# EAGLE design LCD_Backpack_1.8_TFT (EAGLE 5.07)
PROJECT: USB 1,8" TFT BREAKOUT
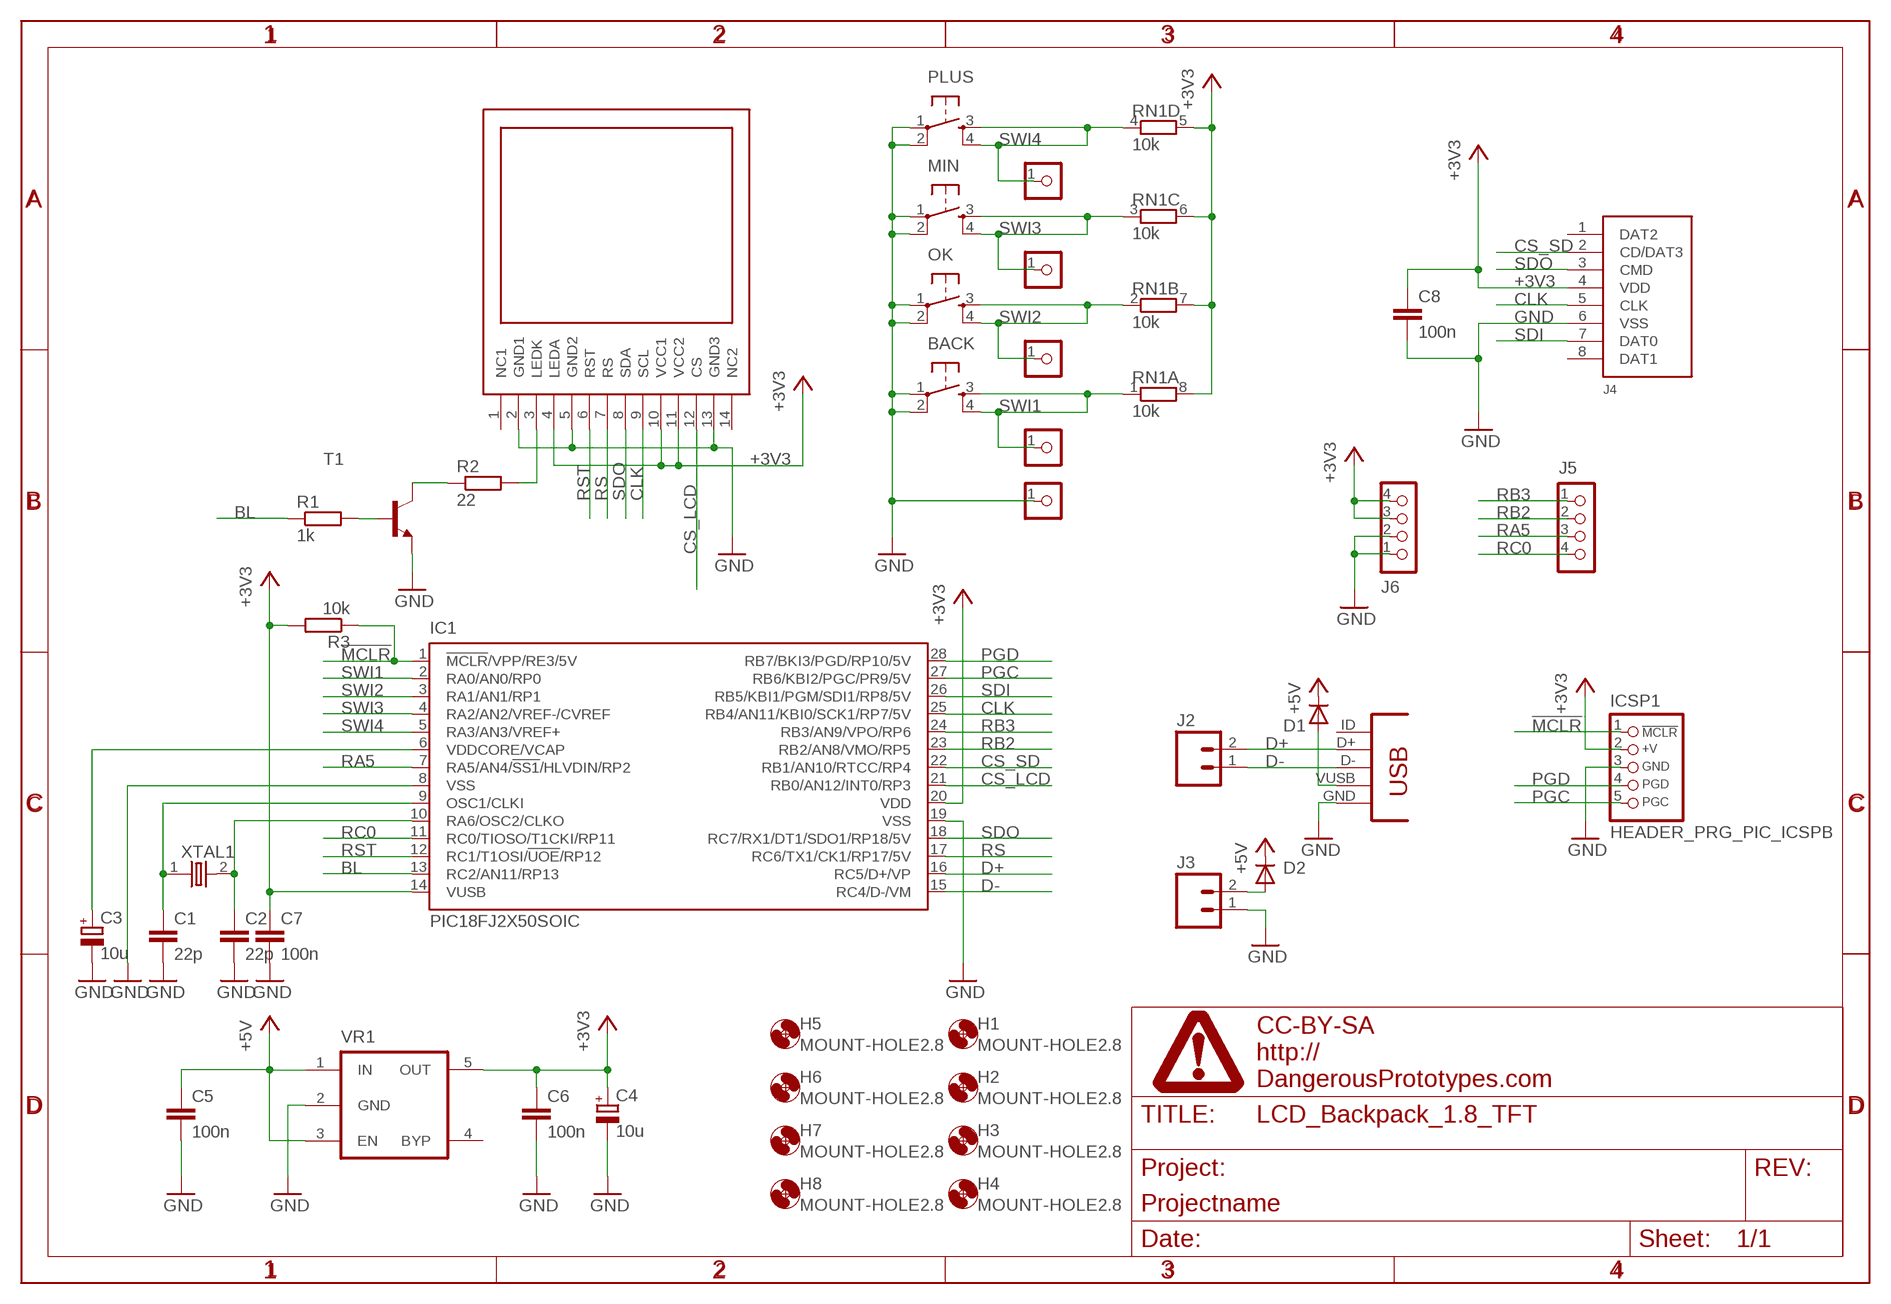
[diagram p0: schematic, sheet 1]

## Parts
BACK  SW-SMD-SMALL  [TACT_SWITCH_SMALL]
C1  22p  CAPC603  [C603]
C2  22p  CAPC603  [C603]
C3  10u  CAP_POLSMC_A  [SMC_A]
C4  10u  CAP_POLSMC_A  [SMC_A]
C5  100n  CAPC603  [C603]
C6  100n  CAPC603  [C603]
C7  100n  CAPC603  [C603]
C8  100n  CAPC603  [C603]
D1  DIODE-SOD-123  [SOD-123]
D2  DIODE-SOD-123  [SOD-123]
H1  MOUNT-HOLE2.8  [2,8]
H2  MOUNT-HOLE2.8  [2,8]
H3  MOUNT-HOLE2.8  [2,8]
H4  MOUNT-HOLE2.8  [2,8]
H5  MOUNT-HOLE2.8  [2,8]
H6  MOUNT-HOLE2.8  [2,8]
H7  MOUNT-HOLE2.8  [2,8]
H8  MOUNT-HOLE2.8  [2,8]
IC1  PIC18FJ2X50SOIC  [SOIC28W]
ICSP1  HEADER_PRG_PIC_ICSPB  [HEADER_PRG_1X05_ICSP_B]
J1  CON-USB-MINI-BUSB1  [CONN_USB_MINI-B]
J2  M02PTH  [1X02]
J3  M02PTH  [1X02]
J4  CON_MICROSDHINGED  [CON_MICROSD_HINGED]
J5  CON_HEADER_1X04  [M1X4]
J6  CON_HEADER_1X04  [M1X4]
J7  CON_HEADER_1X01-PTH  [M1X1]
J8  CON_HEADER_1X01-PTH  [M1X1]
J9  CON_HEADER_1X01-PTH  [M1X1]
J10  CON_HEADER_1X01-PTH  [M1X1]
J11  CON_HEADER_1X01-PTH  [M1X1]
MIN  SW-SMD-SMALL  [TACT_SWITCH_SMALL]
OK  SW-SMD-SMALL  [TACT_SWITCH_SMALL]
PLUS  SW-SMD-SMALL  [TACT_SWITCH_SMALL]
R1  1k  RESISTORR603  [R603]
R2  22  RESISTORR603  [R603]
R3  10k  RESISTORR603  [R603]
RN1  10k  RNETWORK  [RN8P-4R-CRA06S]
T1  BJT-NPNSOT23BEC  [SOT23-BEC]
U$1  LCD18  [LCD18]
U$4  DINA4_L  [DP_LOGO]
VR1  MIC5205  [SOT-23-5]
XTAL1  OSC-XTAL  [HC-49U]

## Nets
!MCLR: IC1.1(!MCLR!/VPP/RE3/5V) ICSP1.1(/MCLR) R3.1
+3V3: C4.+ C6.1 C7.1 C8.1 IC1.14(VUSB) IC1.20(VDD) ICSP1.2(+V) J4.4(VDD) J6.3 J6.4 R3.2 RN1.5 RN1.6 RN1.7 RN1.8 U$1.4(LEDA) U$1.10(VCC1) U$1.11(VCC2) VR1.5(OUT)
+5V: C5.1 D1.C D2.C VR1.1(IN) VR1.3(EN)
BL: IC1.13(RC2/AN11/RP13) R1.1
CLK: IC1.25(RB4/AN11/KBI0/SCK1/RP7/5V) J4.5(CLK) U$1.9(SCL)
CS_LCD: IC1.21(RB0/AN12/INT0/RP3) U$1.12(CS)
CS_SD: IC1.22(RB1/AN10/RTCC/RP4) J4.2(CD/DAT3)
D+: IC1.16(RC5/D+/VP) J1.D+ J2.2
D-: IC1.15(RC4/D-/VM) J1.D- J2.1
GND: BACK.1 BACK.2 C1.2 C2.2 C3.- C4.- C5.2 C6.2 C7.2 C8.2 IC1.8(VSS) IC1.19(VSS) ICSP1.3(GND) J1.GND J3.1 J4.6(VSS) J6.1 J6.2 J11.1 MIN.1 MIN.2 OK.1 OK.2 PLUS.1 PLUS.2 T1.E U$1.2(GND1) U$1.5(GND2) U$1.13(GND3) VR1.2(GND)
N$1: C3.+ IC1.6(VDDCORE/VCAP)
N$2: D1.A J1.VUSB
N$3: D2.A J3.2
N$13: C1.1 IC1.9(OSC1/CLKI) XTAL1.1
N$14: C2.1 IC1.10(RA6/OSC2/CLKO) XTAL1.2
N$15: R2.1 T1.C
N$18: R2.2 U$1.3(LEDK)
N$19: R1.2 T1.B
PGC: IC1.27(RB6/KBI2/PGC/PR9/5V) ICSP1.5(PGC)
PGD: IC1.28(RB7/BKI3/PGD/RP10/5V) ICSP1.4(PGD)
RA5: IC1.7(RA5/AN4/!SS1!/HLVDIN/RP2) J5.3
RB2: IC1.23(RB2/AN8/VMO/RP5) J5.2
RB3: IC1.24(RB3/AN9/VPO/RP6) J5.1
RC0: IC1.11(RC0/TIOSO/T1CKI/RP11) J5.4
RS: IC1.17(RC6/TX1/CK1/RP17/5V) U$1.7(RS)
RST: IC1.12(RC1/T1OSI/!UOE!/RP12) U$1.6(RST)
SDI: IC1.26(RB5/KBI1/PGM/SDI1/RP8/5V) J4.7(DAT0)
SDO: IC1.18(RC7/RX1/DT1/SDO1/RP18/5V) J4.3(CMD) U$1.8(SDA)
SWI1: BACK.3 BACK.4 IC1.2(RA0/AN0/RP0) J10.1 RN1.1
SWI2: IC1.3(RA1/AN1/RP1) J9.1 OK.3 OK.4 RN1.2
SWI3: IC1.4(RA2/AN2/VREF-/CVREF) J8.1 MIN.3 MIN.4 RN1.3
SWI4: IC1.5(RA3/AN3/VREF+) J7.1 PLUS.3 PLUS.4 RN1.4
Unconnected: J1.BODY@1(BODY) J1.BODY@2(BODY) J1.BODY@3(BODY) J1.BODY@4(BODY) J1.ID(USBID) J4.1(DAT2) J4.8(DAT1) U$1.1(NC1) U$1.14(NC2) VR1.4(BYP)

## Library data of the parts
BACK MIN OK PLUS = dp_devices:SW-SMD-SMALL
C1 C2 C5-C8 = dp_devices:CAP
C3 C4 = dp_devices:CAP_POL
D1 D2 = dp_devices:DIODE: Various Diode Packages
H1-H8 = holes:MOUNT-HOLE: MOUNTING HOLE with drill center marker
IC1 = dp_devices:PIC18FJ2X50
ICSP1 = dp_devices:HEADER_PRG_PIC_ICSP: 5-pin PIC In Circuit Serial Programming header
J1 = dp_devices:CON-USB-MINI-B: USB connector
J2 J3 = SparkFun2:M02: Header 2 Standard 2-pin 0.1" header. Use with straight break away headers (SKU : PRT-00116), right angle break away headers (PRT-00553), swiss pins (PRT-00743), machine pins (PRT-00117), and female headers (PRT-00115). Molex polarized connector foot print use with SKU : PRT-08233 with associated crimp pins and housings.
J4 = dp_devices:CON_MICROSD
J5 J6 = dp_devices:CON_HEADER_1X04
J7-J11 = dp_devices:CON_HEADER_1X01
R1-R3 = dp_devices:RESISTOR
RN1 = dp_devices:RNETWORK: 4 Resistor Array 0603
T1 = dp_devices:BJT-NPN: Most commonly used is SOT23-BEC
U$1 = lcd:LCD18
U$4 = dp_devices:DINA4_L: A4 DP frame Standard Dangerous Prototypes schematic frame. Automagically adds the DP logo and standard texts to the PCB Use the atrribute in the schematic editor to change the fields.; FF1: fulfillment by; FF2: Seeed Studio; FF3: www.seeedstudio.com; LICENSE: CC-BY-SA; PROJECT: Projectname; URL1: http://; URL2: DangerousPrototypes.com
VR1 = dp_devices:MIC5205: 150ma Low-Noise LDO Regulator
XTAL1 = dp_devices:OSC-XTAL

## Board
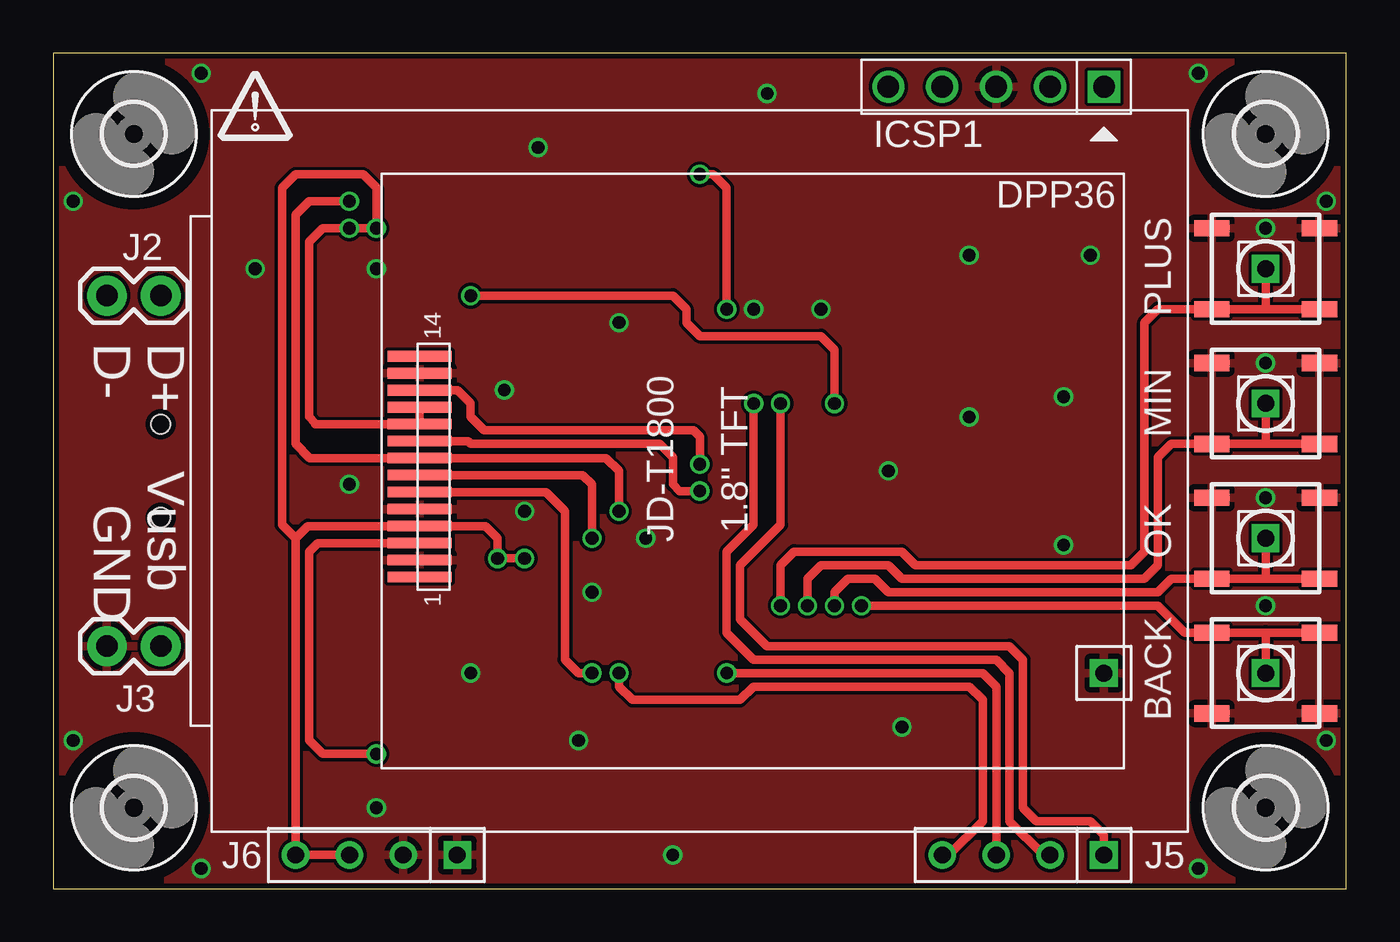
[diagram p1: board, top side]
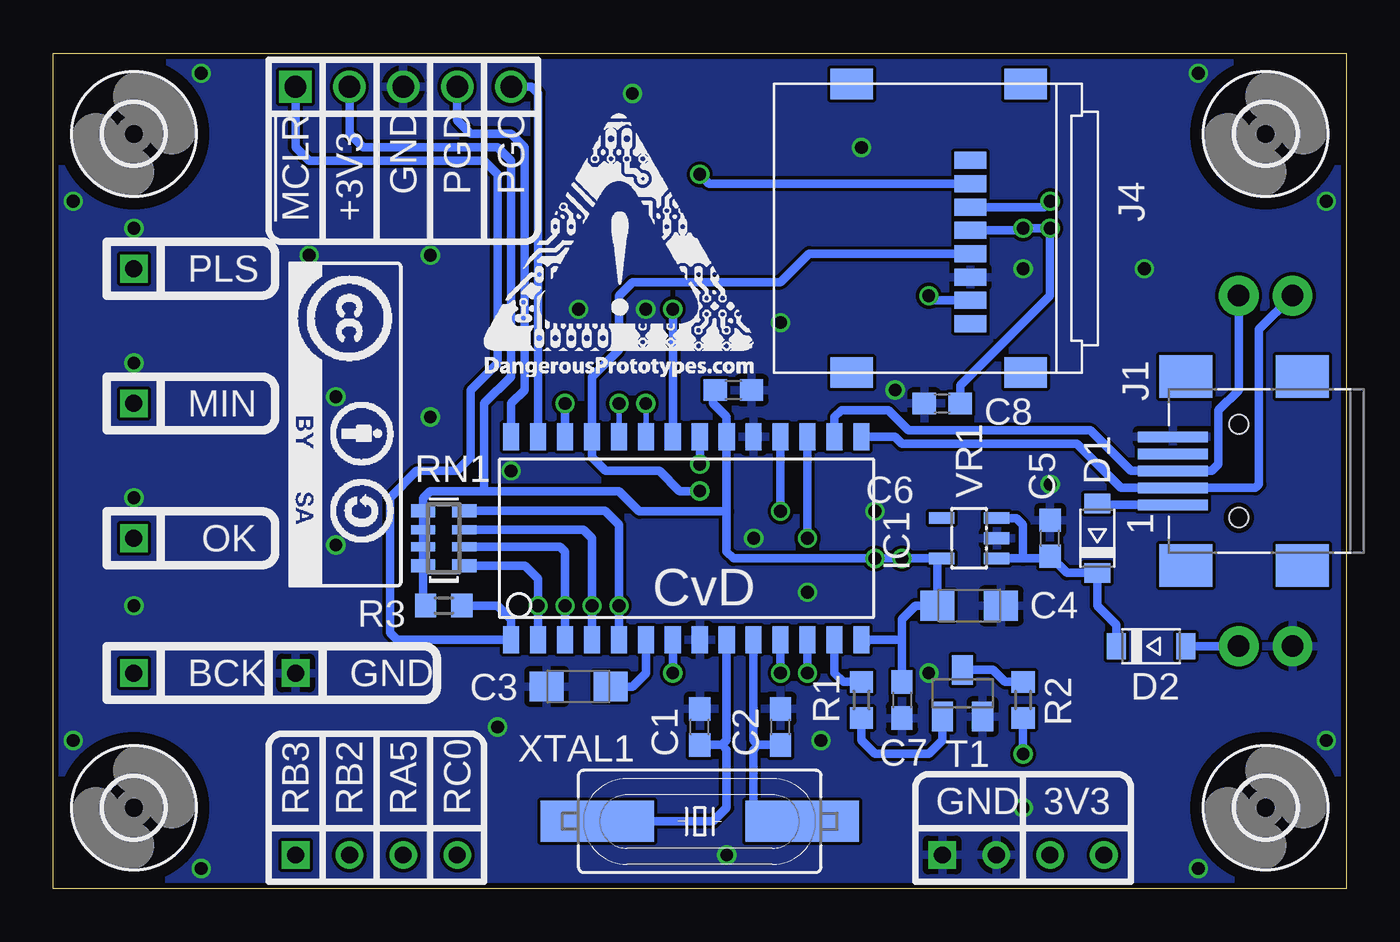
[diagram p2: board, bottom side, seen from below]

Size 60.96 x 39.37 mm. Coordinates in mm from the lower left corner, seen from the top.
Outline: 60.96,39.37 0,39.37 0,0 60.96,0 60.96,39.37
Copper layers (1*16): Top 0.035mm / dielectric 1.5mm / Bottom 0.035mm
Design rules "Fusion_eagle_rule_v1.1": minimum track width 6mil, minimum drill 12mil, track to track 6mil, track to pad 6mil, pad to pad 6mil, via to via 6mil, smd to smd 0mil, copper to edge 10mil, drill to drill 10mil, minimum pad ring 10mil, minimum via ring 6mil, stop-mask expansion 2mil, vias tented up to drill 100mil, thermal gap 10mil

### Footprints (pad centres in the part's own frame; a part is rotated, then mirrored left to right if it is on the bottom)
TACT_SWITCH_SMALL = smd 1.651 x 0.762: 1 -2.54,1.905; 2 2.54,1.905; 3 -2.54,-1.905; 4 2.54,-1.905
C603 = smd 1.1 x 1: 1 -0.85,0; 2 0.85,0
SMC_A = smd 1.6 x 1.4: + -1.5,0; - 1.5,0
SOD-123 = smd 0.91 x 1.22: A 1.635,0; C -1.635,0
2,8 = hole 2.8: 0,0
SOIC28W = smd 0.762 x 1.27: 1 -8.89,-4.78; 2 -7.62,-4.78; 3 -6.35,-4.78; 4 -5.08,-4.78; 5 -3.81,-4.78; 6 -2.54,-4.78; 7 -1.27,-4.78; 8 0,-4.78; 9 1.27,-4.78; 10 2.54,-4.78; 11 3.81,-4.78; 12 5.08,-4.78; 13 6.35,-4.78; 14 7.62,-4.78; 15 7.62,4.78; 16 6.35,4.78; 17 5.08,4.78; 18 3.81,4.78; 19 2.54,4.78; 20 1.27,4.78; 21 0,4.78; 22 -1.27,4.78; 23 -2.54,4.78; 24 -3.81,4.78; 25 -5.08,4.78; 26 -6.35,4.78; 27 -7.62,4.78; 28 -8.89,4.78
HEADER_PRG_1X05_ICSP_B = drill 1.016 square: 1 -5.08,0 | drill 1.016 round: 2 -2.54,0; 3 0,0; 4 2.54,0; 5 5.08,0
CONN_USB_MINI-B = smd 2 x 2.5: BODY@1 -4.45,2.5; BODY@2 4.45,2.5; BODY@3 4.45,-3; BODY@4 -4.45,-3 | smd 0.5 x 3.3: D+ 0,3.1; D- -0.8,3.1; GND 1.6,3.1; ID 0.8,3.1; VUSB -1.6,3.1 | hole 0.9: -2.2,0; 2.2,0
1X02 = drill 1.016 pad 1.88 round: 1 0,0; 2 2.54,0
CON_MICROSD_HINGED = smd 0.8 x 1.5: 1 -3.2,2.6; 2 -2.1,2.6; 3 -1,2.6; 4 0.1,2.6; 5 1.2,2.6; 6 2.3,2.6; 7 3.4,2.6; 8 4.5,2.6 | smd 1.45 x 2: BODY@1 -6.8,5.2; BODY@2 -6.8,-3; BODY@3 6.8,-3; BODY@4 6.8,5.2
M1X4 = drill 0.8 square: 1 0,0 | drill 0.8 round: 2 2.54,0; 3 5.08,0; 4 7.62,0
M1X1 = drill 0.8 square: 1 0,0
R603 = smd 1 x 1.1: 1 -0.85,0; 2 0.85,0
RN8P-4R-CRA06S = smd 0.63 x 1.15: 1 -1.295,-0.975; 4 1.295,-0.975; 5 1.295,0.975; 8 -1.295,0.975 | smd 0.44 x 1.15: 2 -0.4,-0.975; 3 0.4,-0.975; 6 0.4,0.975; 7 -0.4,0.975
SOT23-BEC = smd 1 x 1.4: B -0.95,-1.1; C 0,1.1; E 0.95,-1.1
LCD18 = smd 3 x 0.5: 1 13.2,5; 2 13.2,4.2; 3 13.2,3.4; 4 13.2,2.6; 5 13.2,1.8; 6 13.2,1; 7 13.2,0.2; 8 13.2,-0.6; 9 13.2,-1.4; 10 13.2,-2.2; 11 13.2,-3; 12 13.2,-3.8; 13 13.2,-4.6; 14 13.2,-5.4
SOT-23-5 = smd 0.55 x 1.2: 1 -0.95,-1.3; 2 0,-1.3; 3 0.95,-1.3; 4 0.95,1.3; 5 -0.95,1.3
HC-49U = smd 5.334 x 1.93: 1 -4.826,0; 2 4.826,0

### Placement (x,y rotation side)
BACK  57.15,10.16 180 top
C1  30.48,7.62 90 bottom
C2  26.67,7.62 90 bottom
C3  36.2,9.53 180 bottom
C4  17.78,13.34 0 bottom
C5  13.97,16.51 90 bottom
C6  28.89,23.5 0 bottom
C7  20.95,8.89 270 bottom
C8  19.05,22.86 180 bottom
D1  11.75,16.51 90 bottom
D2  9.21,11.43 0 bottom
H1  3.81,3.81 180 bottom
H2  3.81,35.56 180 bottom
H3  57.15,35.56 180 bottom
H4  57.15,3.81 180 bottom
H5  3.81,35.56 0 top
H6  3.81,3.81 0 top
H7  57.15,3.81 0 top
H8  57.15,35.56 0 top
IC1  30.48,16.51 0 bottom
ICSP1  44.45,37.78 180 top
J1  5.08,19.68 90 bottom
J2  2.54,27.94 0 top
J3  2.54,11.43 0 top
J4  20.32,31.11 270 bottom
J5  49.53,1.59 180 top
J6  19.05,1.59 180 top
J7  57.15,29.21 0 top
J8  57.15,22.86 0 top
J9  57.15,16.51 0 top
J10  57.15,10.16 0 top
J11  49.53,10.16 0 top
MIN  57.15,22.86 0 top
OK  57.15,16.51 0 top
PLUS  57.15,29.21 0 top
R1  22.86,8.89 270 bottom
R2  15.24,8.89 270 bottom
R3  42.55,13.34 180 bottom
RN1  42.55,16.51 90 bottom
T1  18.1,9.21 0 bottom
U$1  30.48,19.68 180 top
U$2  [DP_LOGO_ART_0.5X0.5]  40.64,24.13 0 bottom
U$3  [CC-BY-SA]  49.85,29.53 270 bottom
U$4  9.53,35.88 0 top
VR1  17.78,16.51 90 bottom
XTAL1  30.48,3.17 0 bottom

### Tracks (layer width: path | path; a pad name or v marks a point on that pad's centre or on a via)
!MCLR
  Bottom 0.406: R3.1 40.01,13.34 39.37,12.7 IC1.1 44.75,11.73 45.09,12.06 45.09,18.41 43.81,19.68 41.91,19.68 41.27,20.32 41.27,23.5 40.01,24.77 40.01,33.66 40.64,34.29 48.9,34.29 49.53,34.92 ICSP1.1
+3V3  (via drill 0.6)
  Top 0.406: U$1.11 U$1.10 12.36,21.89 12.36,21.93 12.06,22.23 12.06,30.48 12.7,31.11 v15.24,31.11 15.24,33.02 14.61,33.66 11.43,33.66 10.79,33.02 10.79,17.14 11.43,16.51 | J6.3 J6.4 11.43,16.51 | v22.23,15.56 v20.95,15.56 20.95,16.51 20.38,17.09 U$1.4 12.01,17.09 11.43,16.51
  Bottom 0.406: 22.64,11.52 IC1.14 20.95,11.73 | VR1.5 19.05,15.53 | 29.21,17.78 IC1.20 29.21,22.23 29.84,22.86 29.84,23.39 C6.1 | 29.21,17.78 29.21,15.88 28.89,15.56 VR1.5 | 20.95,11.73 C7.1 | 20.95,11.73 20.95,12.7 20.32,13.34 C4.+ 19.28,15.36 VR1.5 | R3.2 43.52,13.46 RN1.8 RN1.7 RN1.6 RN1.5 43.52,18.39 43.18,18.73 40.64,18.73 | 40.64,18.73 34.29,18.73 33.34,17.78 29.21,17.78 | 40.64,18.73 40.64,22.86 39.37,24.13 39.37,34.29 40.01,34.92 46.35,34.92 46.99,35.56 ICSP1.2 | J4.4 15.34,31.02 v15.24,31.11 v13.97,31.11 13.97,27.94 18.2,23.71 C8.1 | v20.95,15.56 VR1.5
+5V
  Bottom 0.406: 15.24,15.56 VR1.1 | 15.24,15.56 14.07,15.56 C5.1 13.19,14.88 D1.C 11.75,13.34 10.84,12.43 D2.C | VR1.3 15.55,17.46 15.24,17.14 15.24,15.56
BL
  Bottom 0.406: IC1.13 24.13,10.16 23.71,9.74 R1.1
CLK  (via drill 0.6)
  Top 0.406: v30.48,18.73 29.53,18.73 29.21,19.05 29.21,20.32 28.57,20.95 19.68,20.95 19.55,21.09 U$1.9
  Bottom 0.406: J4.5 25.33,29.91 26.67,28.57 33.66,28.57 34.29,27.94 34.29,25.4 35.56,24.13 IC1.25 35.56,20.32 34.92,19.68 32.38,19.68 31.43,18.73 v30.48,18.73
CS_LCD  (via drill 0.6)
  Top 0.406: U$1.12 19.06,23.48 19.68,22.86 19.68,22.23 20.32,21.59 30.18,21.59 IC1.21 v30.48,20
  Bottom 0.406: v30.48,20 IC1.21
CS_SD  (via drill 0.6)
  Top 0.406: v31.75,27.3 31.75,33.02 31.11,33.66 v30.48,33.66
  Bottom 0.406: v31.75,27.3 IC1.22 | J4.2 30.04,33.22 v30.48,33.66
D+
  Bottom 0.406: J2.2 5.08,23.5 6.03,22.54 6.03,20 6.35,19.68 J1.D+ 10.16,19.68 12.06,21.59 20.64,21.59 21.59,22.54 23.81,22.54 24.13,22.23 IC1.16
D-
  Bottom 0.406: J2.1 4.13,26.35 4.13,19.05 4.29,18.89 J1.D- 10.63,18.89 12.7,20.95 20.95,20.95 21.29,21.29 IC1.15
GND  (via drill 0.6)
  other vias: 19.68,10.16 57.15,13.34 57.15,24.77 57.15,18.41 57.15,31.11 33.02,27.3 26.67,26.67 36.2,27.3 22.23,17.78 53.98,38.42 15.24,29.21 0.95,6.99 6.99,0.95 53.98,0.95 0.95,32.38 6.99,38.42 60.01,32.38 9.53,29.21 43.18,29.84 48.9,29.84 47.62,23.18 43.18,22.23 29.21,1.59 24.77,6.99 15.24,3.81 47.62,16.19 60.01,6.99 40.01,7.62 33.66,37.47 22.86,34.92 27.94,16.51 25.4,13.97 39.37,19.68 13.97,19.05 21.27,23.5
  pour Bottom: 60.96,0 60.96,39.37 0,39.37 0,0
  pour Top: 60.96,0 60.96,39.37 0,39.37 0,0
N$1
  Bottom 0.406: IC1.6 33.02,10.16 33.66,9.53 C3.+
N$2
  Bottom 0.406: J1.VUSB 11.69,18.09 D1.A
N$3
  Bottom 0.406: D2.A J3.2
N$13
  Bottom 0.406: IC1.9 29.21,6.99 29.43,6.77 | 29.43,6.77 C1.1 | XTAL1.1 29.84,3.17 29.21,3.81 29.21,6.55 29.43,6.77
N$14
  Bottom 0.406: IC1.10 27.94,6.99 27.73,6.77 | 27.73,6.77 C2.1 | XTAL1.2 27.3,3.17 27.94,3.81 27.94,6.55 27.73,6.77
N$15
  Bottom 0.406: T1.C 16.66,10.31 16.09,9.74 R2.1
N$18  (via drill 0.6)
  Top 0.406: U$1.3 12.47,16.29 12.06,15.88 12.06,6.99 12.7,6.35 v15.24,6.35
  Bottom 0.406: v15.24,6.35 R2.2
N$19
  Bottom 0.406: R1.2 22.86,6.99 22.23,6.35 19.68,6.35 19.05,6.99 T1.B
PGC
  Bottom 0.406: IC1.27 38.1,37.47 38.42,37.78 ICSP1.5
PGD
  Bottom 0.406: IC1.28 39.37,22.86 38.73,23.5 38.73,34.92 39.37,35.56 41.27,35.56 41.91,36.2 ICSP1.4
RA5  (via drill 0.6)
  Top 0.406: v31.75,10.16 43.81,10.16 44.45,9.53 J5.3
  Bottom 0.406: IC1.7 v31.75,10.16
RB2  (via drill 0.6)
  Top 0.406: J5.2 46.67,1.59 45.09,3.17 45.09,10.16 44.45,10.79 33.02,10.79 31.75,12.06 31.75,15.88 33.02,17.14 v33.02,22.86
  Bottom 0.254: v33.02,22.86 IC1.23
RB3  (via drill 0.6)
  Top 0.406: J5.1 49.53,2.54 48.9,3.17 46.35,3.17 45.72,3.81 45.72,10.79 45.09,11.43 33.66,11.43 32.38,12.7 32.38,15.24 34.29,17.14 v34.29,22.86
  Bottom 0.254: v34.29,22.86 IC1.24
RC0  (via drill 0.6)
  Top 0.406: J5.4 42.23,1.59 43.81,3.17 43.81,8.89 43.18,9.53 33.02,9.53 32.38,8.89 27.3,8.89 26.67,9.53 v26.67,10.16
  Bottom 0.406: v26.67,10.16 IC1.11
RS  (via drill 0.6)
  Top 0.406: U$1.7 24.96,19.48 25.4,19.05 v25.4,16.51
  Bottom 0.406: v25.4,16.51 IC1.17
RST  (via drill 0.6)
  Top 0.406: U$1.6 23.23,18.68 24.13,17.78 24.13,10.79 24.77,10.16 v25.4,10.16
  Bottom 0.406: v25.4,10.16 IC1.12
SDI  (via drill 0.6)
  Top 0.406: v36.83,22.86 36.83,25.4 36.2,26.04 30.48,26.04 29.84,26.67 29.84,27.3 29.21,27.94 v19.68,27.94
  Bottom 0.406: v36.83,22.86 IC1.26 | J4.7 19.46,27.71 v19.68,27.94
SDO  (via drill 0.6)
  Top 0.406: v26.67,17.78 26.67,19.68 26.07,20.29 U$1.8 12.1,20.29 11.43,20.95 11.43,31.75 12.06,32.38 v13.97,32.38
  Bottom 0.406: v26.67,17.78 IC1.18 | J4.3 14.24,32.12 v13.97,32.38
SWI1  (via drill 0.6)
  Top 0.406: v38.1,13.34 52.07,13.34 53.34,12.06 BACK.4 57.15,12.06 | 57.15,12.06 BACK.3 | 57.15,12.06 J10.1
  Bottom 0.406: IC1.2 v38.1,13.34 38.1,14.61 38.71,15.21 RN1.1
SWI2  (via drill 0.6)
  Top 0.406: 57.15,14.61 OK.3 52.7,14.61 52.07,13.97 39.37,13.97 38.73,14.61 37.47,14.61 36.83,13.97 v36.83,13.34 | 57.15,14.61 OK.4 | 57.15,14.61 J9.1
  Bottom 0.406: IC1.3 v36.83,13.34 36.83,15.88 37.06,16.11 RN1.2
SWI3  (via drill 0.6)
  Top 0.406: 57.15,20.95 MIN.3 52.7,20.95 52.07,20.32 52.07,15.24 51.44,14.61 40.01,14.61 39.37,15.24 36.2,15.24 35.56,14.61 v35.56,13.34 | 57.15,20.95 MIN.4 | 57.15,20.95 J8.1
  Bottom 0.406: IC1.4 v35.56,13.34 35.56,16.51 35.96,16.91 RN1.3
SWI4  (via drill 0.6)
  Top 0.406: 57.15,27.3 PLUS.3 52.07,27.3 51.44,26.67 51.44,15.88 50.8,15.24 40.64,15.24 40.01,15.88 34.92,15.88 34.29,15.24 v34.29,13.34 | 57.15,27.3 PLUS.4 | 57.15,27.3 J7.1
  Bottom 0.406: IC1.5 v34.29,13.34 34.29,17.14 34.95,17.8 RN1.4

### Text on the board
tPlace: DPP36 | D- | D+ | Vusb | GND
bPlace: PGC | PGD | GND | +3V3 | !MCLR | PLS | MIN | OK | CvD | GND | BCK | 3V3 | GND | RC0 | RA5 | RB2 | RB3